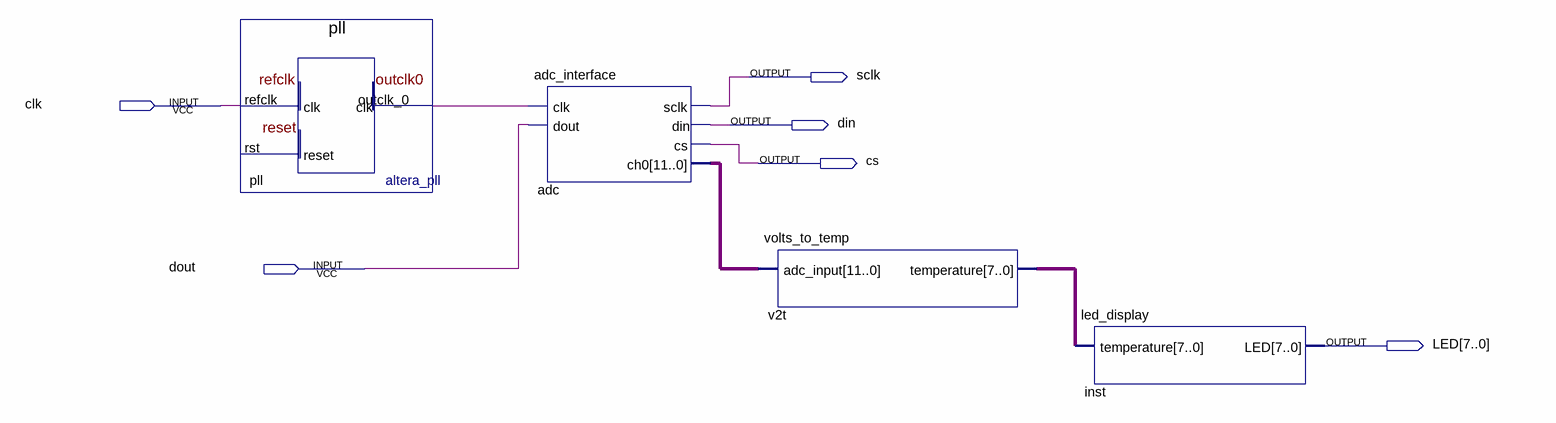
[diagram p0: schematic sheet]
// Quartus schematic ir-temp-sensor.bdf as structural Verilog: 4 symbols, 6 pins
module \ir-temp-sensor  (
  input  clk,
  input  dout,
  output sclk,
  output din,
  output cs,
  output [7:0] LED
);

  wire pll_outclk_0;
  wire [7:0] v2t_temperature;
  wire [11:0] adc_ch0;

  pll pll (.refclk(clk), .outclk_0(pll_outclk_0));  // open: rst
  adc_interface adc (.clk(pll_outclk_0), .dout(dout), .sclk(sclk), .din(din), .cs(cs), .ch0(adc_ch0));
  volts_to_temp v2t (.adc_input(adc_ch0), .temperature(v2t_temperature));
  led_display inst (.temperature(v2t_temperature), .LED(LED));
endmodule
